# Altium project HotPlate_v1.0.PrjPcb
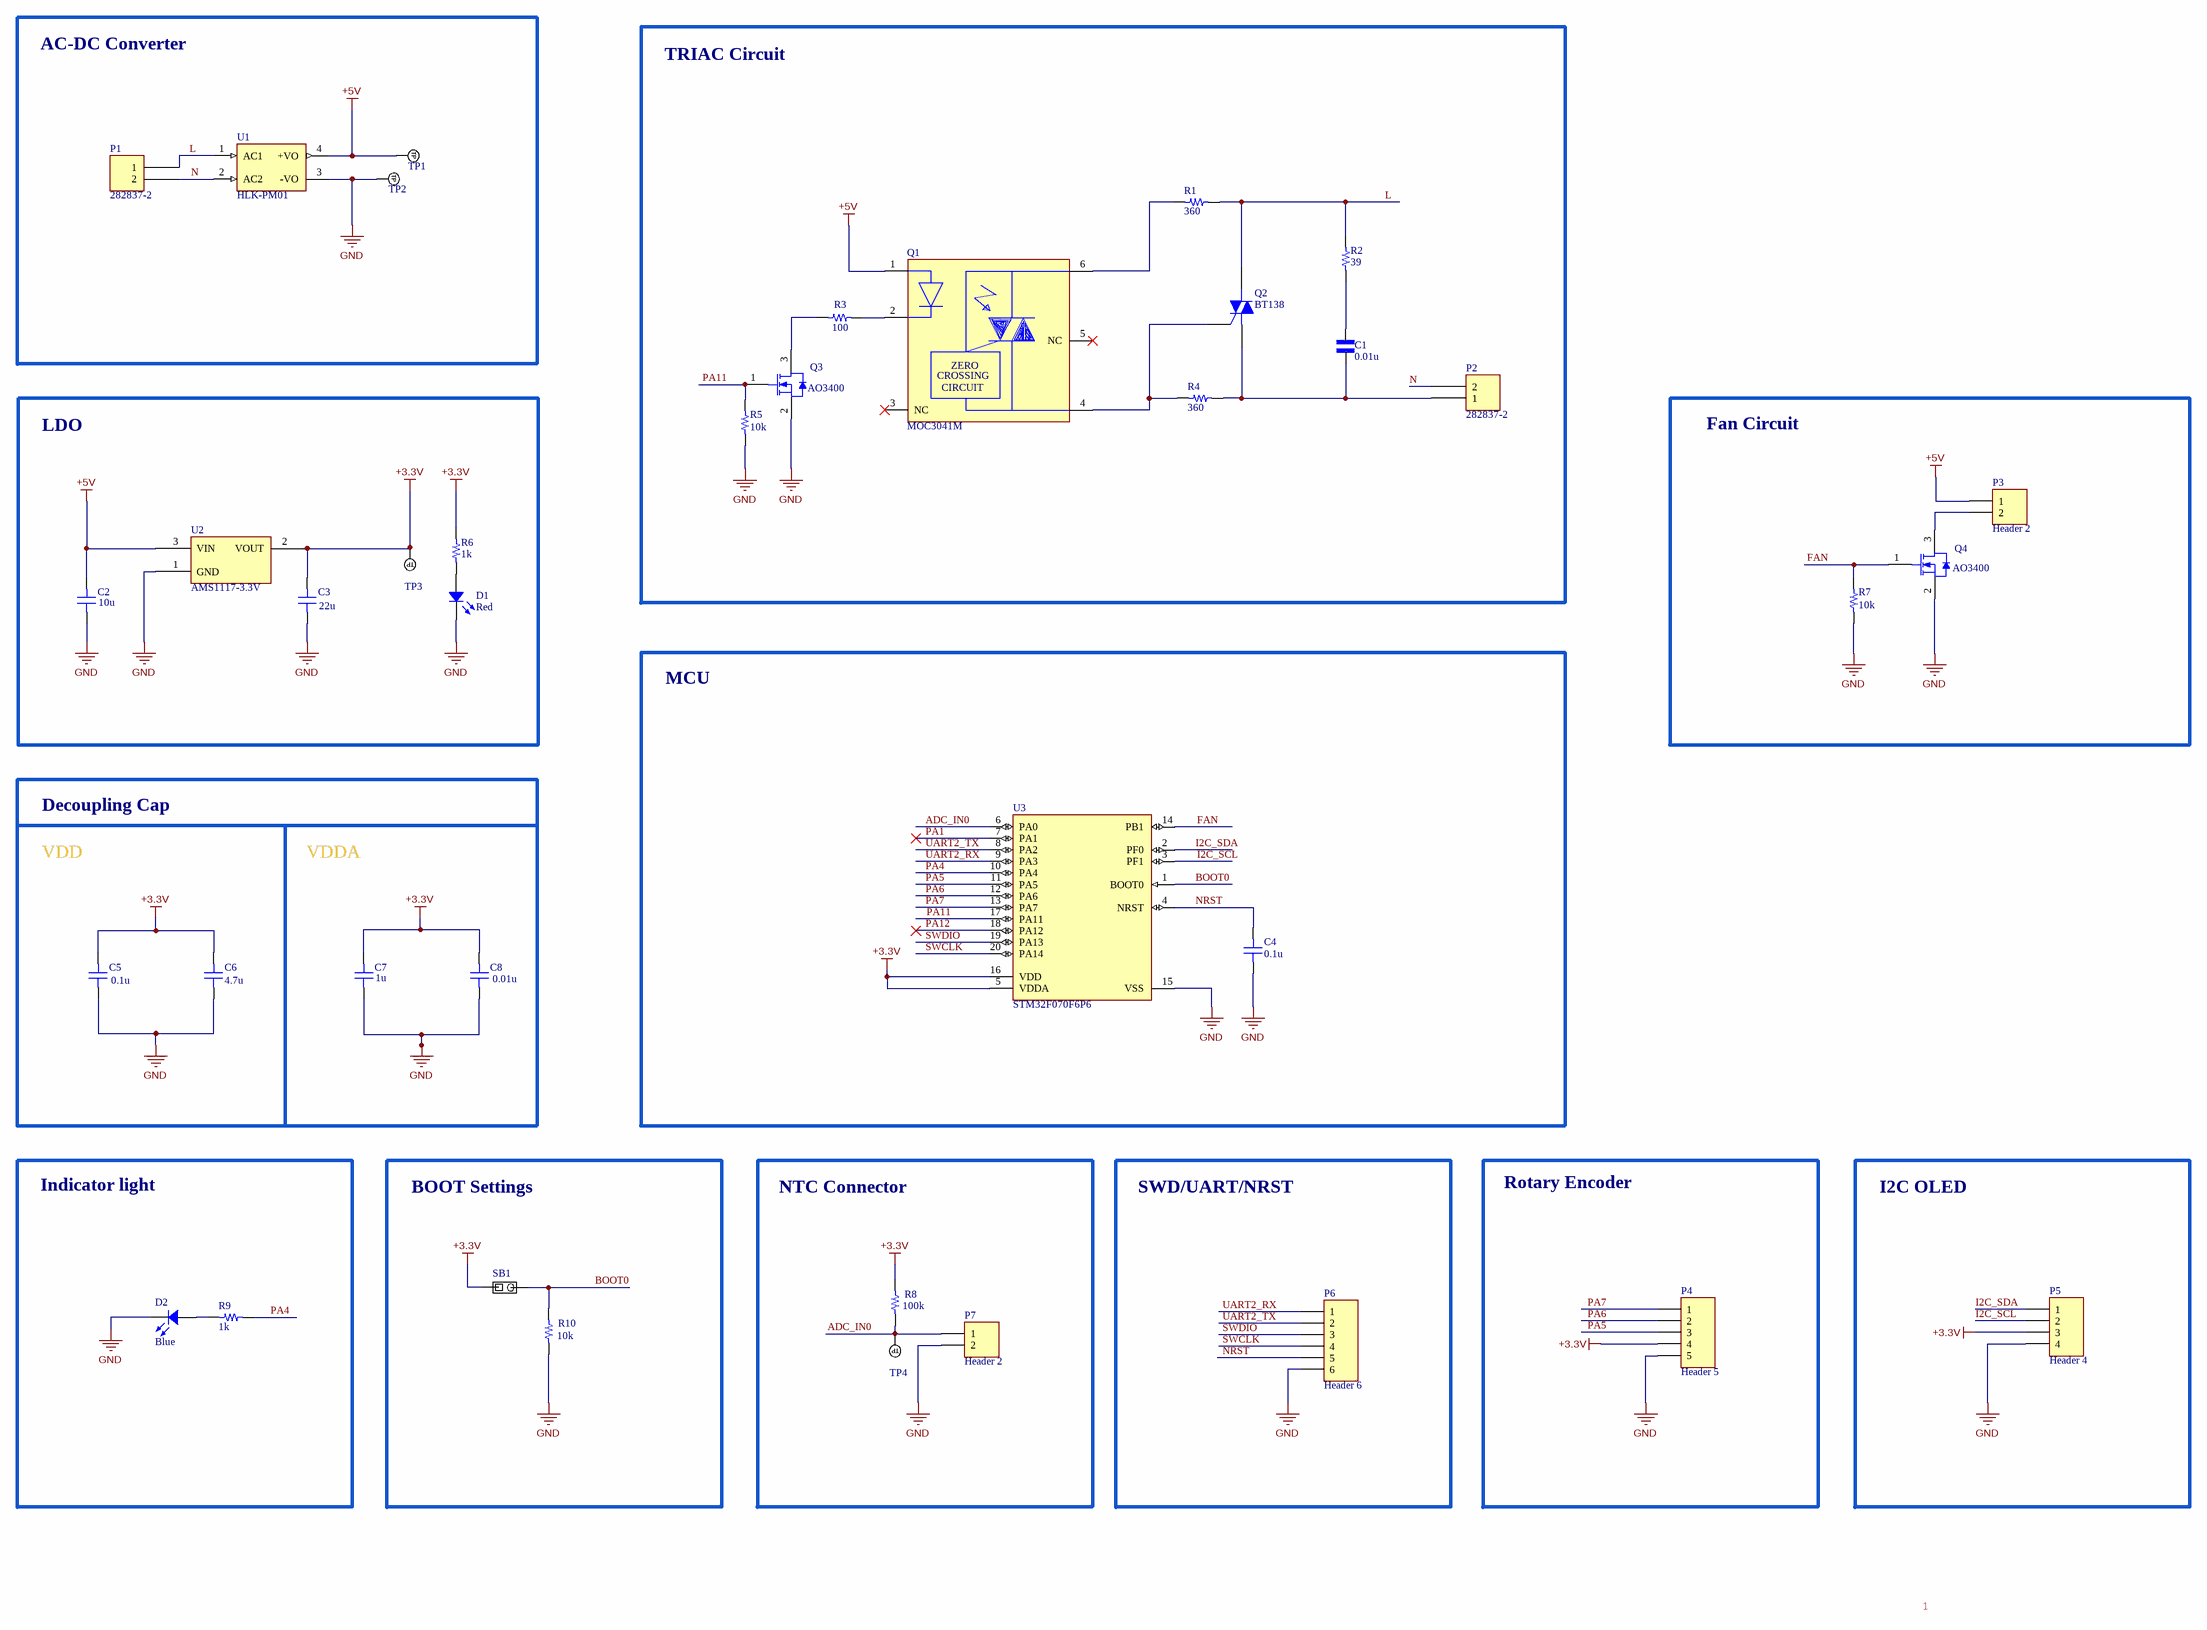
[diagram p0: main.SchDoc]
date: 3/9/2024; designer: Nguyen Dang Khoa; project: STM32F070-Hotplate
1 sheet, 39 parts. Net scope: global (net labels, ports and power ports of the same name join across sheets).
Board file: main.PcbDoc

## Sheet main.SchDoc
size C; SheetNumber: 1; SheetTotal: 1

### Parts
C1  0.01u  [CAPRR1000W60L1250T450H750]
C2  10u  [CAP 1206_3216 - 0.8MM]
C3  22u  [CAP 1206_3216 - 0.8MM]
C4  0.1u  [CAP 0603_1608]
C5  0.1u  [CAP 0603_1608]
C6  4.7u  [CAP 0603_1608]
C7  1u  [CAP 0603_1608]
C8  0.01u  [CAP 0603_1608]
D1  Red  [LED 0805_2012 RED]
D2  Blue  [LED 0805_2012 BLUE]
P1  282837-2  [TE 282837-2]
P2  282837-2  [TE 282837-2]
P3  Header 2  [HDR1X2]
P4  Header 5  [HDR1X5]
P5  Header 4  [HDR1X4]
P6  Header 6  [HDR1X6]
P7  Header 2  [HDR1X2]
Q1  MOC3041M  [FP-646BX-MFG]
Q2  BT138  [MY_TO220V_heatsink]
Q3  AO3400  [AO-SOT23-3_V]
Q4  AO3400  [AO-SOT23-3_V]
R1  360  [RES 2512_6432]
R2  39  [RES 1206_3216]
R3  100  [RES 0603_1608]
R4  360  [RES 2512_6432]
R5  10k  [RES 0603_1608]
R6  1k  [RES 0603_1608]
R7  10k  [RES 0603_1608]
R8  100k  [RES 0603_1608]
R9  1k  [RES 0603_1608]
R10  10k  [RES 0603_1608]
SB1  Solder Jumper  [SolderJumper_Single]  (value not drawn)
TP1  TP_NOBOM  [PAD_RND_1MM]  (value not drawn)  (no BOM)
TP2  TP_NOBOM  [PAD_RND_1MM]  (value not drawn)  (no BOM)
TP3  TP_NOBOM  [PAD_RND_1MM]  (value not drawn)  (no BOM)
TP4  TP_NOBOM  [PAD_RND_1MM]  (value not drawn)  (no BOM)
U1  HLK-PM01  [CONV_HLK-PM01]
U2  AMS1117-3.3V  [SOT-223]
U3  STM32F070F6P6  [STM-TSSOP20_M]

### Blocks framed on the sheet
AC-DC Converter: P1 TP1 TP2 U1
TRIAC Circuit: C1 P2 Q1-Q3 R1-R5
LDO: C2 C3 D1 R6 TP3 U2
Fan Circuit: P3 Q4 R7
MCU: C4 U3
Indicator light: D2 R9
BOOT Settings: R10 SB1
NTC Connector: P7 R8 TP4
SWD/UART/NRST: P6
Rotary Encoder: P4
I2C OLED: P5

### Nets
+3.3V: C3.1 C5.1 C6.1 C7.1 C8.1 P4.4 P5.3 R6.1 R8.1 SB1.1 TP3.1(TP) U2.2(VOUT) U3.5(VDDA) U3.16(VDD)
+5V: C2.1 P3.1 Q1.1(A) TP1.1(TP) U1.4(+VO) U2.3(VIN)
GND: C2.2 C3.2 C4.2 C5.2 C6.2 C7.2 C8.2 D1.2 D2.2 P4.5 P5.4 P6.6 P7.2 Q3.2(S) Q4.2(S) R5.2 R7.2 R10.2 TP2.1(TP) U1.3(-VO) U2.1(GND) U3.15(VSS)
ADC_IN0: P7.1 R8.2 TP4.1(TP) U3.6(PA0)
BOOT0: R10.1 SB1.2 U3.1(BOOT0)
FAN: Q4.1(G) R7.1 U3.14(PB1)
I2C_SCL: P5.2 U3.3(PF1)
I2C_SDA: P5.1 U3.2(PF0)
L: P1.1 Q2.2(M2) R1.1 R2.1 U1.1(AC1)
N: P1.2 P2.2 U1.2(AC2)
NRST: C4.1 P6.5 U3.4(NRST)
PA1: U3.7(PA1)
PA4: R9.2 U3.10(PA4)
PA5: P4.3 U3.11(PA5)
PA6: P4.2 U3.12(PA6)
PA7: P4.1 U3.13(PA7)
PA11: Q3.1(G) R5.1 U3.17(PA11)
PA12: U3.18(PA12)
SWCLK: P6.4 U3.20(PA14)
SWDIO: P6.3 U3.19(PA13)
UART2_RX: P6.1 U3.9(PA3)
UART2_TX: P6.2 U3.8(PA2)
NetC1_1: C1.1 R2.2
NetC1_2: C1.2 P2.1 Q2.1(M1) R4.2
NetD1_1: D1.1 R6.2
NetD2_1: D2.1 R9.1
NetP3_2: P3.2 Q4.3(D)
NetQ1_2: Q1.2(C) R3.2
NetQ1_4: Q1.4(1_MAIN_TERM.) Q2.3(G) R4.1
NetQ1_6: Q1.6(2_MAIN_TERM.) R1.2
NetQ3_3: Q3.3(D) R3.1

Not connected (* = marked no-connect by the designer): Q1 3(NC)* 5(NC)*

### Notes on the sheet
- Decoupling Cap
- VDD
- VDDA
- 1
- (in symbol CMP-07144-000005-1) ZERO; CROSSING; CIRCUIT

### Library data of the parts
C1 = ECQE6103KT: MF: {'manufacturer': u'Panasonic'}; Package: None; Price: None; Value: *; MP: ECQE6103KT; Availability: Unavailable
C2 = CL31B106KOHVPNE: CAP CER 10UF 16V X7R 1206; manufacturer: Samsung Electro-Mechanics; Value: 10 µF; Tolerance: ±10%; Part Number: CL31B106KOHVPNE; Applications: Automotive; Capacitance: 10 µF; componentlink1description: Datasheet; componentlink1url: http://www.samsungsem.com/kr/support/product-search/mlcc/CL31B106KOHVPNE.jsp; componentlink2description: DigiKey Link; componentlink2url: https://www.digikey.com/en/products/detail/samsung-electro-mechanics/CL31B106KOHVPNE/5961281; Device Package: 1206 (3216 Metric); lastupdated: 6/4/2024 7:10:40 PM; Lifecycle Status: Active; Minimum Order: 1; Mounting Type: Surface Mount, MLCC; Operating Temperature: -55°C ~ 125°C; Package / Case: 1206 (3216 Metric); packaging: TapeAndReel; partid: 20135; Part Status: Active; price: 0.06; Ratings: AEC-Q200; series: CL; Size / Dimension: 0.126" L x 0.063" W (3.20mm x 1.60mm); Supplier 1: DigiKey; Supplier Part Number 1: 1276-6797-1-ND; Temperature Coefficient: X7R; Thickness (Max): 0.071" (1.80mm); Voltage - Rated: 16V
C3 = CL31A226KOCLFNC: CAP CER 22UF 16V X5R 1206; manufacturer: Samsung Electro-Mechanics; Value: 22 µF; Tolerance: ±10%; Part Number: CL31A226KOCLFNC; Applications: General Purpose; Capacitance: 22 µF; componentlink1description: Datasheet; componentlink1url: http://www.samsungsem.com/kr/support/product-search/mlcc/CL31A226KOCLFNC.jsp; componentlink2description: DigiKey Link; componentlink2url: https://www.digikey.com/en/products/detail/samsung-electro-mechanics/CL31A226KOCLFNC/3888383; Device Package: 1206 (3216 Metric); lastupdated: 6/4/2024 7:10:41 PM; Lifecycle Status: Active; Minimum Order: 1; Mounting Type: Surface Mount, MLCC; Operating Temperature: -55°C ~ 85°C; Package / Case: 1206 (3216 Metric); packaging: TapeAndReel; partid: 18940; Part Status: Active; price: 0.09; series: CL; Size / Dimension: 0.126" L x 0.063" W (3.20mm x 1.60mm); Supplier 1: DigiKey; Supplier Part Number 1: 1276-2725-1-ND; Temperature Coefficient: X5R; Thickness (Max): 0.037" (0.95mm); Voltage - Rated: 16V
C4 C5 = CL10B104KB8NNNL: CAP CER 0.1UF 50V X7R 0603; manufacturer: Samsung Electro-Mechanics; Value: 0.1 µF; Tolerance: ±10%; Part Number: CL10B104KB8NNNL; Applications: General Purpose; Capacitance: 0.1 µF; componentlink1description: Datasheet; componentlink1url: http://www.samsungsem.com/kr/support/product-search/mlcc/CL10B104KB8NNNL.jsp; componentlink2description: DigiKey Link; componentlink2url: https://www.digikey.com/en/products/detail/samsung-electro-mechanics/CL10B104KB8NNNL/3894274; Device Package: 0603 (1608 Metric); lastupdated: 2/9/2024 8:10:29 PM; Lifecycle Status: Active; Minimum Order: 1; Mounting Type: Surface Mount, MLCC; Operating Temperature: -55°C ~ 125°C; Package / Case: 0603 (1608 Metric); packaging: TapeAndReel; partid: 3517; Part Status: Active; price: 0.01; series: CL; Size / Dimension: 0.063" L x 0.031" W (1.60mm x 0.80mm); Supplier 1: DigiKey; Supplier Part Number 1: 1276-CL10B104KB8NNNLCT-ND; Temperature Coefficient: X7R; Thickness (Max): 0.035" (0.90mm); Voltage - Rated: 50V
C6 = CL10A475KL8NRNC: CAP CER 4.7UF 35V X5R 0603; manufacturer: Samsung Electro-Mechanics; Value: 4.7 µF; Tolerance: ±10%; Part Number: CL10A475KL8NRNC; Applications: General Purpose; Capacitance: 4.7 µF; componentlink1description: Datasheet; componentlink1url: http://www.samsungsem.com/kr/support/product-search/mlcc/CL10A475KL8NRNC.jsp; componentlink2description: DigiKey Link; componentlink2url: https://www.digikey.com/en/products/detail/samsung-electro-mechanics/CL10A475KL8NRNC/5961278; Device Package: 0603 (1608 Metric); lastupdated: 2/9/2024 8:10:30 PM; Lifecycle Status: Active; Minimum Order: 1; Mounting Type: Surface Mount, MLCC; Operating Temperature: -55°C ~ 85°C; Package / Case: 0603 (1608 Metric); packaging: TapeAndReel; partid: 2652; Part Status: Active; price: 0.08; series: CL; Size / Dimension: 0.063" L x 0.031" W (1.60mm x 0.80mm); Supplier 1: DigiKey; Supplier Part Number 1: 1276-6794-1-ND; Temperature Coefficient: X5R; Thickness (Max): 0.035" (0.90mm); Voltage - Rated: 35V
C7 = CL10A105KO8NNNC: CAP CER 1UF 16V X5R 0603; manufacturer: Samsung Electro-Mechanics; Value: 1 µF; Tolerance: ±10%; Part Number: CL10A105KO8NNNC; Applications: General Purpose; Capacitance: 1 µF; componentlink1description: Datasheet; componentlink1url: http://www.samsungsem.com/kr/support/product-search/mlcc/CL10A105KO8NNNC.jsp; componentlink2description: DigiKey Link; componentlink2url: https://www.digikey.com/en/products/detail/samsung-electro-mechanics/CL10A105KO8NNNC/3886692; Device Package: 0603 (1608 Metric); lastupdated: 2/9/2024 8:10:26 PM; Lifecycle Status: Active; Minimum Order: 1; Mounting Type: Surface Mount, MLCC; Operating Temperature: -55°C ~ 85°C; Package / Case: 0603 (1608 Metric); packaging: TapeAndReel; partid: 5514; Part Status: Active; price: 0.01; series: CL; Size / Dimension: 0.063" L x 0.031" W (1.60mm x 0.80mm); Supplier 1: DigiKey; Supplier Part Number 1: 1276-1034-1-ND; Temperature Coefficient: X5R; Thickness (Max): 0.035" (0.90mm); Voltage - Rated: 16V
C8 = CL10B103KC8NNNC: CAP CER 10000PF 100V X7R 0603; manufacturer: Samsung Electro-Mechanics; Tolerance: ±10%; Part Number: CL10B103KC8NNNC; Value: 10000 pF; Applications: General Purpose; Capacitance: 10000 pF; componentlink1description: Datasheet; componentlink1url: http://www.samsungsem.com/kr/support/product-search/mlcc/CL10B103KC8NNNC.jsp; componentlink2description: DigiKey Link; componentlink2url: https://www.digikey.com/en/products/detail/samsung-electro-mechanics/CL10B103KC8NNNC/3886854; Device Package: 0603 (1608 Metric); lastupdated: 2/9/2024 8:10:26 PM; Lifecycle Status: Active; Minimum Order: 1; Mounting Type: Surface Mount, MLCC; Operating Temperature: -55°C ~ 125°C; Package / Case: 0603 (1608 Metric); packaging: TapeAndReel; partid: 5732; Part Status: Active; price: 0.01; series: CL; Size / Dimension: 0.063" L x 0.031" W (1.60mm x 0.80mm); Supplier 1: DigiKey; Supplier Part Number 1: 1276-1196-1-ND; Temperature Coefficient: X7R; Thickness (Max): 0.035" (0.90mm); Voltage - Rated: 100V
D1 = VFHV1112H-3BZ2B-TR: LED; Manufacturer: Stanley Electric Co; Configuration: Standard; Current - Test: 20mA; Lens Color: White; Lens Size: 1.30mm x 1.25mm; Lens Style: Rectangle with Flat Top; Millicandela Rating: 110mcd; Viewing Angle: 140°; Voltage - Forward (Vf) (Typ): 1.9V; Wavelength - Dominant: 615nm; Wavelength - Peak: 624nm; Part Number: VFHV1112H-3BZ2B-TR; Color: Red; ComponentLink1Description: Datasheet; ComponentLink1URL: http://www.stanley-components.com/php/downloaddatafile.php?rp=0,VFHV1112H-3BZ2B-TR_e.pdf; ComponentLink2Description: DigiKey Link; ComponentLink2URL: http://digikey.com/product-detail/en/stanley-electric-co/VFHV1112H-3BZ2B-TR/404-1314-1-ND/9477319; Device Package: 0805 (2012 Metric); Height (Max): 0.90mm; LastUpdated: 6/3/2024 8:00:06 PM; Lifecycle Status: Active; Minimum Order: 1; Mounting Type: Surface Mount; Package / Case: 0805 (2012 Metric); Packaging: TapeAndReel; PartId: 359; Part Status: Active; Price: 0.08; Series: -; Size / Dimension: 2.00mm L x 1.25mm W; Supplier 1: DigiKey; Supplier Part Number 1: 404-1314-1-ND; Value: Red
D2 = XZFBB54W-8: LED BLUE CLEAR CHIP SMD; Manufacturer: SunLED; Configuration: Standard; Current - Test: 20mA; Lens Color: Colorless; Lens Size: 0.80mm Dia; Lens Style: Round with Domed Top; Millicandela Rating: 597mcd; Viewing Angle: 30°; Voltage - Forward (Vf) (Typ): 3.3V; Wavelength - Dominant: 470nm; Wavelength - Peak: 465nm; Part Number: XZFBB54W-8; Color: Blue; ComponentLink1Description: Datasheet; ComponentLink1URL: https://www.sunledusa.com/products/spec/XZFBB54W-8.pdf; ComponentLink2Description: DigiKey Link; ComponentLink2URL: https://www.digikey.com/en/products/detail/sunled/XZFBB54W-8/8259044; Device Package: 0805 (2012 Metric); Height (Max): 1.20mm; LastUpdated: 6/3/2024 7:58:02 PM; Lens Transparency: Clear; Lifecycle Status: Active; Minimum Order: 1; Mounting Type: Surface Mount; Package / Case: 0805 (2012 Metric); Packaging: TapeAndReel; PartId: 757; Part Status: Active; Price: 0.15; Series: -; Size / Dimension: 2.00mm L x 1.25mm W; Supplier 1: DigiKey; Supplier Part Number 1: 1497-1437-1-ND; Supplier Device Package: Chip LED; Value: Blue
P1 P2 = 282837-2: TERM BLK 2P SIDE ENT 5.08MM PCB; Manufacturer: TE Connectivity AMP Connectors; Current: 13.5 A; Mating Orientation: Horizontal with Board; Number of Levels: 1; Pitch: 0.200" (5.08mm); Positions Per Level: 2; Voltage: 300 V; Wire Gauge: 16-28 AWG; Wire Termination: Screw - Rising Cage Clamp; Part Number: 282837-2; Color: Green; ComponentLink1Description: Datasheet; ComponentLink1URL: https://www.te.com/commerce/DocumentDelivery/DDEController?Action=srchrtrv&DocNm=282837&DocType=Customer+Drawing&DocLang=English; ComponentLink2Description: DigiKey Link; ComponentLink2URL: https://www.digikey.com/en/products/detail/te-connectivity-amp-connectors/282837-2/2187973; Features: Interlocking (Side); LastUpdated: 6/21/2022 3:00:23 PM; Lifecycle Status: Active; Minimum Order: 1; Mounting Type: Through Hole; Packaging: Tray; Part Status: Active; Price: 0.31; Series: Buchanan; Supplier 1: DigiKey; Supplier Part Number 1: A113320-ND
P3 P7 = Header 2: Header, 2-Pin; LatestRevisionDate: 17-Jul-2002; LatestRevisionNote: Re-released for DXP Platform.; Publisher: Altium Limited
P4 = Header 5: Header, 5-Pin; LatestRevisionDate: 17-Jul-2002; LatestRevisionNote: Re-released for DXP Platform.; Publisher: Altium Limited
P5 = Header 4: Header, 4-Pin; LatestRevisionDate: 17-Jul-2002; LatestRevisionNote: Re-released for DXP Platform.; Publisher: Altium Limited
P6 = Header 6: Header, 6-Pin; LatestRevisionDate: 17-Jul-2002; LatestRevisionNote: Re-released for DXP Platform.; Publisher: Altium Limited
Q1 = CMP-07144-000005-1: OPTOISOLATOR 4.17KV TRIAC 6DIP; Manufacturer: ON Semiconductor; Forward Voltage: 1.25V; Power Dissipation: 250mW; Forward Current: 30mA; Reverse Voltage: 6V; Max Junction Temp: +100°C; Isolation Voltage: 4170Vrms; Standoff Height: 0.38mm; Octopart: https://octopart.com/moc3041m-on+semiconductor-84330395; Temperature Range Low: -40°C; Category: Trans; Package: 646BX; Height: 5.08mm; Manufacturer Part Number: MOC3041M; ComponentLink2Description: Datasheet; Device Class L2: Optocouplers; Device Class L1: Optoelectronics; Device Class L3: unset; Automotive: No; RoHS: TRUE; Mouser Description: Optocoupler Triac AC Output 1 Channel 400VDRM 6-Pin Plastic Dip White Bulk; Temperature: -40°C to +85°C; Lead Free: Yes; ComponentLink2URL: https://www.onsemi.com/pub/Collateral/MOC3043M-D.pdf; Digikey Description: OPTOISOLATOR 4.17KV TRIAC 6DIP; Temperature Range High: +85°C; Footprint Url: https://www.onsemi.com/pub/Collateral/646BX.PDF
Q2 = BT138: Silicon Bidirectional Triode Thyristor; ASiD Part Number: BT138-AS
Q3 Q4 = CMP-0278-00001-1: N-channel Enhancement Mode Field-Effect Transistor; 5.8A/30V; Manufacturer: Alpha and Omega; Channel Type: N; Drain-Source Voltage Limit: 30 V; Junction Temperature: -55 to 150 degC; Gate-Source Voltage Limit: +/-12 V; PackageDescription: 3-Pin SOT23, 3.016 x 2.8 mm Body, 0.95 mm Pitch; ComponentLink2Description: Datasheet; DatasheetVersion: Rev.8, 12/2011; ComponentLink3URL: http://www.aosmd.com/res/packaging_information/SOT-23.pdf; Storage Temperature: -55 to 150 degC; ComponentLink3Description: Package Specification; PackageReference: SOT23; ComponentLink1Description: Manufacturer URL; Mounting Technology: Surface Mount; ComponentLink1URL: http://www.aosmd.com/; PartNumber: AO3400; ComponentLink2URL: http://www.aosmd.com/res/data_sheets/AO3400.pdf
R1 R4 = RMCF2512FT360R: RES 360 OHM 1% 1W 2512; manufacturer: Stackpole Electronics Inc; Resistance: 360 Ohms; Temperature Coefficient: ±100ppm/°C; value: 360 Ohms; Part Number: RMCF2512FT360R; componentlink1description: Datasheet; componentlink1url: https://www.seielect.com/catalog/sei-rmcf_rmcp.pdf; componentlink2description: DigiKey Link; componentlink2url: http://digikey.com/product-detail/en/stackpole-electronics-inc/RMCF2512FT360R/RMCF2512FT360RCT-ND/7907116; Composition: Thick Film; Device Package: 2512 (6432 Metric); Features: Automotive AEC-Q200; Height - Seated (Max): 0.028" (0.70mm); lastupdated: 9/2/2020 1:26:55 AM; Lifecycle Status: Active; Minimum Order: 1; Number of Terminations: 2; Operating Temperature: -55°C ~ 155°C; Package / Case: 2512 (6432 Metric); packaging: TapeAndReel; Part Status: Active; Power (Watts): 1W; price: 0.04; Ratings: AEC-Q200; series: RMCF; Size / Dimension: 0.248" L x 0.126" W (6.30mm x 3.20mm); Supplier 1: DigiKey; Supplier Part Number 1: RMCF2512FT360RCT-ND; Supplier Device Package: 2512; Tolerance: ±1%
R2 = RMCF1206JT39R0: RES 39 OHM 5% 1/4W 1206; Manufacturer: Stackpole Electronics Inc; Power (Watts): 0.25W, 1/4W; Resistance: 39 Ohms; Temperature Coefficient: ±200ppm/°C; Value: 39 Ohms; Part Number: RMCF1206JT39R0; ComponentLink1Description: Datasheet; ComponentLink1URL: https://www.seielect.com/catalog/sei-rmcf_rmcp.pdf; ComponentLink2Description: DigiKey Link; ComponentLink2URL: https://www.digikey.com/en/products/detail/stackpole-electronics-inc/RMCF1206JT39R0/1753828; Composition: Thick Film; Device Package: 1206 (3216 Metric); Features: Automotive AEC-Q200; Height - Seated (Max): 0.028" (0.70mm); LastUpdated: 2/9/2024 8:54:36 PM; Lifecycle Status: Active; Minimum Order: 1; Number of Terminations: 2; Operating Temperature: -55°C ~ 155°C; Package / Case: 1206 (3216 Metric); Packaging: CutTape; PartId: 28850; Part Status: Active; Price: 0.01; Ratings: AEC-Q200; Series: RMCF; Size / Dimension: 0.126" L x 0.063" W (3.20mm x 1.60mm); Supplier 1: DigiKey; Supplier Part Number 1: RMCF1206JT39R0CT-ND; Supplier Device Package: 1206; Tolerance: ±5%
R3 = RNCS0603BKE100R: RES 100 OHM 0.1% 1/16W 0603; Manufacturer: Stackpole Electronics Inc; Value: 100 Ohms; Power (Watts): 0.063W, 1/16W; Temperature Coefficient: ±25ppm/°C; Part Number: RNCS0603BKE100R; ComponentLink1Description: Datasheet; ComponentLink1URL: https://www.seielect.com/catalog/sei-rncs_rnch.pdf; ComponentLink2Description: DigiKey Link; ComponentLink2URL: https://www.digikey.com/en/products/detail/stackpole-electronics-inc/RNCS0603BKE100R/1799988; Composition: Thin Film; Device Package: 0603 (1608 Metric); Features: Anti-Corrosive, Automotive AEC-Q200, Moisture Resistant; Height - Seated (Max): 0.022" (0.55mm); LastUpdated: 2/9/2024 8:43:37 PM; Lifecycle Status: Active; Minimum Order: 1; Number of Terminations: 2; Operating Temperature: -55°C ~ 155°C; Package / Case: 0603 (1608 Metric); Packaging: TapeAndReel; PartId: 4839; Part Status: Active; Price: 0.06; Ratings: AEC-Q200; Resistance: 100 Ohms; Series: RNCS; Size / Dimension: 0.061" L x 0.031" W (1.55mm x 0.80mm); Supplier 1: DigiKey; Supplier Part Number 1: RNCS0603BKE100RCT-ND; Supplier Device Package: 0603; Tolerance: ±0.1%
R5 R7 R10 = RNCS0603BKE10K0: RES 10K OHM 0.1% 1/16W 0603; Manufacturer: Stackpole Electronics Inc; Value: 10 kOhms; Power (Watts): 0.063W, 1/16W; Temperature Coefficient: ±25ppm/°C; Part Number: RNCS0603BKE10K0; ComponentLink1Description: Datasheet; ComponentLink1URL: https://www.seielect.com/catalog/sei-rncs_rnch.pdf; ComponentLink2Description: DigiKey Link; ComponentLink2URL: https://www.digikey.com/en/products/detail/stackpole-electronics-inc/RNCS0603BKE10K0/1708836; Composition: Thin Film; Device Package: 0603 (1608 Metric); Features: Anti-Corrosive, Automotive AEC-Q200, Moisture Resistant; Height - Seated (Max): 0.022" (0.55mm); LastUpdated: 2/9/2024 8:43:37 PM; Lifecycle Status: Active; Minimum Order: 1; Number of Terminations: 2; Operating Temperature: -55°C ~ 155°C; Package / Case: 0603 (1608 Metric); Packaging: TapeAndReel; PartId: 4838; Part Status: Active; Price: 0.06; Ratings: AEC-Q200; Resistance: 10 kOhms; Series: RNCS; Size / Dimension: 0.061" L x 0.031" W (1.55mm x 0.80mm); Supplier 1: DigiKey; Supplier Part Number 1: RNCS0603BKE10K0CT-ND; Supplier Device Package: 0603; Tolerance: ±0.1%
R6 R9 = RNCS0603BKE1K00: RES 1K OHM 0.1% 1/16W 0603; Manufacturer: Stackpole Electronics Inc; Value: 1 kOhms; Power (Watts): 0.063W, 1/16W; Temperature Coefficient: ±25ppm/°C; Part Number: RNCS0603BKE1K00; ComponentLink1Description: Datasheet; ComponentLink1URL: https://www.seielect.com/catalog/sei-rncs_rnch.pdf; ComponentLink2Description: DigiKey Link; ComponentLink2URL: https://www.digikey.com/en/products/detail/stackpole-electronics-inc/RNCS0603BKE1K00/1708845; Composition: Thin Film; Device Package: 0603 (1608 Metric); Features: Anti-Corrosive, Automotive AEC-Q200, Moisture Resistant; Height - Seated (Max): 0.022" (0.55mm); LastUpdated: 2/9/2024 8:42:50 PM; Lifecycle Status: Active; Minimum Order: 1; Number of Terminations: 2; Operating Temperature: -55°C ~ 155°C; Package / Case: 0603 (1608 Metric); Packaging: TapeAndReel; PartId: 16793; Part Status: Active; Price: 0.06; Ratings: AEC-Q200; Resistance: 1 kOhms; Series: RNCS; Size / Dimension: 0.061" L x 0.031" W (1.55mm x 0.80mm); Supplier 1: DigiKey; Supplier Part Number 1: RNCS0603BKE1K00CT-ND; Supplier Device Package: 0603; Tolerance: ±0.1%
R8 = RNCS0603BKE100K: RES 100K OHM 0.1% 1/16W 0603; Manufacturer: Stackpole Electronics Inc; Value: 100 kOhms; Power (Watts): 0.063W, 1/16W; Temperature Coefficient: ±25ppm/°C; Part Number: RNCS0603BKE100K; ComponentLink1Description: Datasheet; ComponentLink1URL: https://www.seielect.com/catalog/sei-rncs_rnch.pdf; ComponentLink2Description: DigiKey Link; ComponentLink2URL: https://www.digikey.com/en/products/detail/stackpole-electronics-inc/RNCS0603BKE100K/1708835; Composition: Thin Film; Device Package: 0603 (1608 Metric); Features: Anti-Corrosive, Automotive AEC-Q200, Moisture Resistant; Height - Seated (Max): 0.022" (0.55mm); LastUpdated: 2/9/2024 8:43:37 PM; Lifecycle Status: Active; Minimum Order: 1; Number of Terminations: 2; Operating Temperature: -55°C ~ 155°C; Package / Case: 0603 (1608 Metric); Packaging: TapeAndReel; PartId: 4849; Part Status: Active; Price: 0.06; Ratings: AEC-Q200; Resistance: 100 kOhms; Series: RNCS; Size / Dimension: 0.061" L x 0.031" W (1.55mm x 0.80mm); Supplier 1: DigiKey; Supplier Part Number 1: RNCS0603BKE100KCT-ND; Supplier Device Package: 0603; Tolerance: ±0.1%
SB1 = SolderJumper_Single: Solder Jumper Single 0.5mm Pitch
TP1-TP4 = TEST_POINT_RND_1MM: Test Point Round 1mm (NO BOM)
U1 = HLK-PM01: MF: {'manufacturer': u'Hi-link'}; Package: None; Price: None; Value: *; MP: HLK-PM01; Availability: Unavailable
U2 = AMS1117-3.3V: IC LDO REGULATOR 3.3V 1A SOT223; ComponentLink1Description: Datasheet; ComponentLink1URL: http://ams-semitech.com/attachments/File/AMS1117_20120314.pdf; Output voltage: 3.3V; Part Number: AMS1117-3.3V
U3 = CMP-0304-00145-2: ARM Cortex-M0 32-bit MCU, 32 KB Flash, 6 KB Internal RAM, 15 I/Os, 20-Pin TSSOP, -40 to 85 degC, Tray; Manufacturer: STMicroelectronics; FLASH Size (Prog) (kB): 32; Internal RAM Size (kB): 6; Operating Frequency(F) (Processor speed) (MHz): 48; Supply Voltage(Vcc) min (V): 2.4; I/Os (High Current): 15; ComponentLink2URL: http://www.st.com/st-web-ui/static/active/en/resource/technical/document/datasheet/DM00141386.pdf; ComponentLink2Description: Datasheet; Packing: Tray; DatasheetVersion: Rev. 3; PartNumber: STM32F070F6P6; Core: ARM Cortex-M0; Package Reference: TSSOP20; Package Description: 20-Pin Thin Shrink Small Outline Package, Body 6.5 x 4.4 mm, Pitch 0.65 mm; ComponentLink1Description: Manufacturer URL; ComponentLink1URL: http://www.st.com/; Mounting Technology: Surface Mount